# Altium schematic sheet Schematic1_1核心板.schdoc (part 3 of 3)
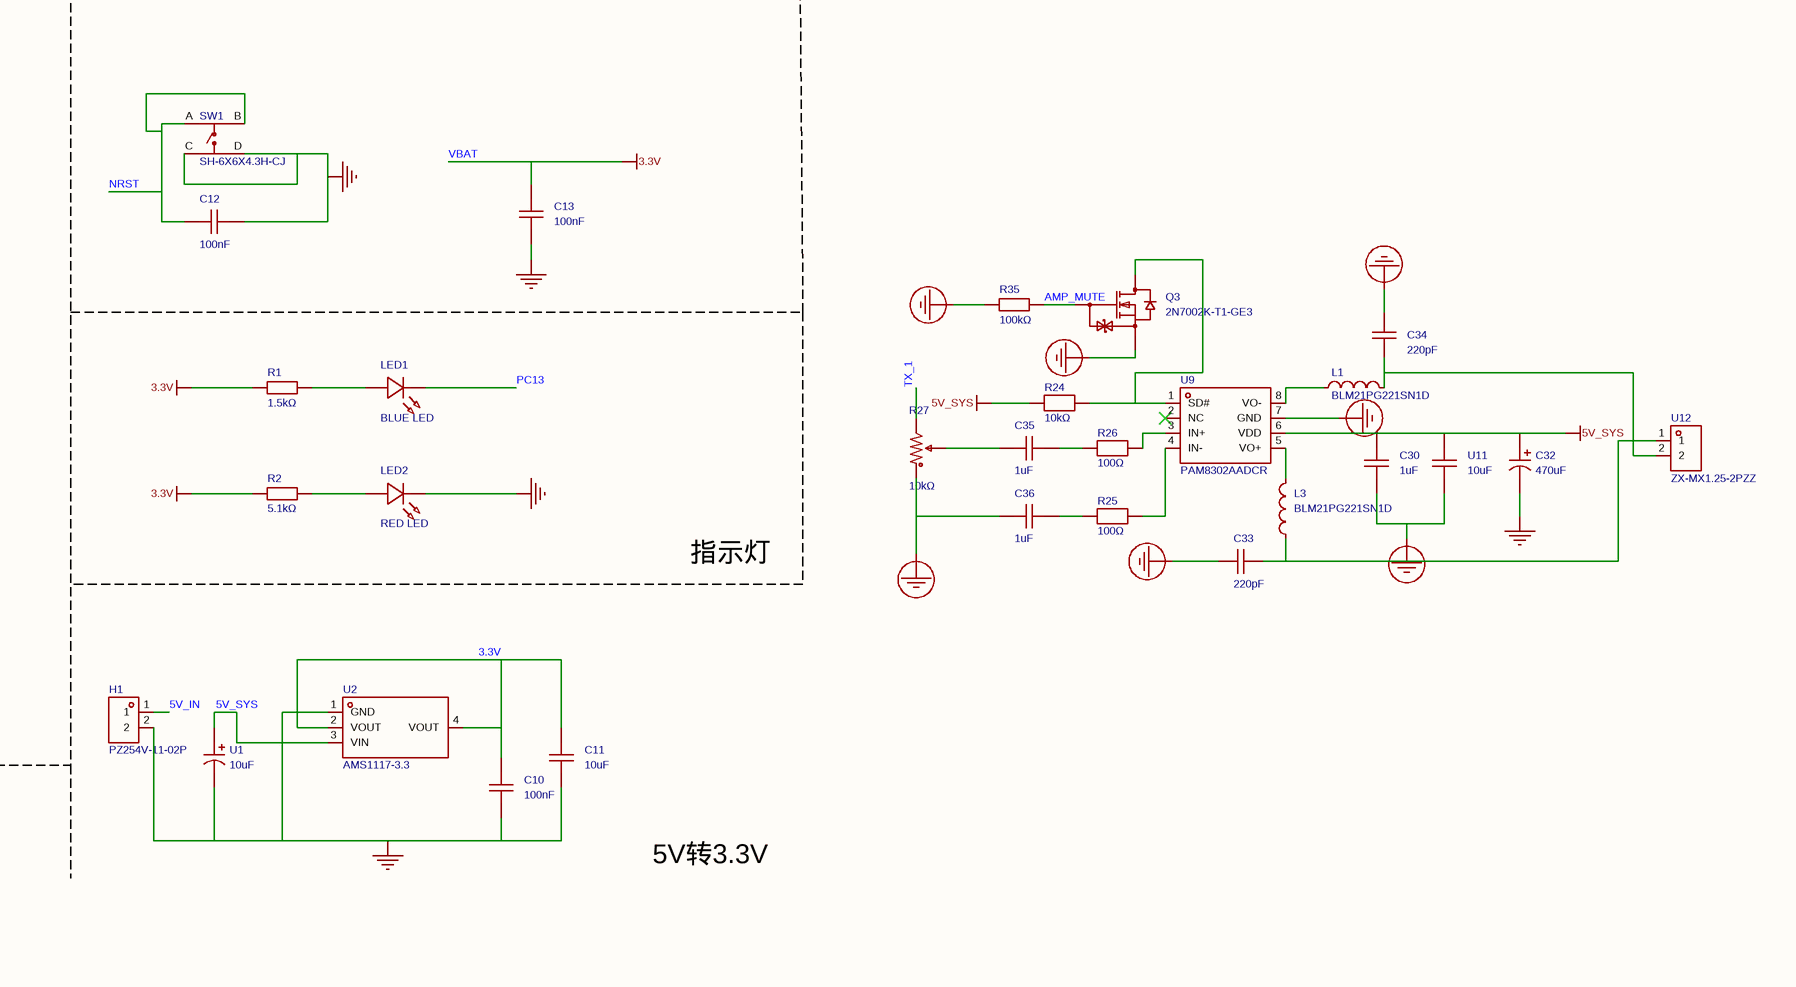
[diagram p5: Schematic1_1核心板.schdoc, bottom right]

## Library data of the parts (continued)
U8 = TPS7A2033PDBVR: 输出类型:固定;最大输入电压:6V;输出电压:3.3V;输出电流:300mA;输出极性:正极;; Manufacturer: TI(德州仪器); AddInBom: yes; ModelId: 7ba65df16e7b4570af156e925f9c37fe0819f05c4eef4c71ace90d822a990e87; ModelTransform: 114.173,114.173,0,90,0,0,0,0,0; Output Type: 固定; Maximum Input Voltage: 6V; Output Voltage: 3.3V; Output Current: 300mA; Dropout Voltage: 140mV@(300mA); standby current: 15uA; Output Polarity: 正极; Number of Outputs: 1; Symbol: TPS7A2033PDBVR; Device: TPS7A2033PDBVR; LCSC Part Name: 具有高 PSRR 的 300mA、超低噪声、低 IQ、低压降 (LDO) 线性稳压器; SupplierPart: C2862740; ManufacturerPart: TPS7A2033PDBVR; Supplier Footprint: SOT-23-5; JLCPCB Part Class: Extended Part; Datasheet: https://www.ti.com/cn/lit/gpn/tps7a20; Supplier: LCSC; ConvertToPcb: yes; FootprintName: SOT-23-5_L2.9-W1.6-P0.95-LS2.8-BR; ModelName: SOT-23-5_L2.9-W1.6-P0.95-LS2.8-BR; Feature: 防静电保护；软启动；浪涌保护；低ESR；热保护(TSD)；欠压闭锁；过流保护(OCP)；带使能；防倒灌; Operating Temperature: -40℃~+125℃@(Tj)
U9 = PAM8302AADCR: 功放类型:D类功放;扬声器通道数:单声道;输出功率:2.5Wx1@4Ω;静态电流(Iq):4mA;; Manufacturer: DIODES(美台); AddInBom: yes; ModelId: 75c24a7891ee4dd6bdac16a7163ff87e0819f05c4eef4c71ace90d822a990e87; ModelName: SOP-8_L4.9-W3.9-P1.27-LS6.0-BL-1; ModelTransform: 192.913,236.22,0,0,0,0,-0.393,2.749,0; Class: D类功放; Speaker Channels: 单声道; Total Harmonic Distortion + Noise (THD+N): 0.3%; Quiescent Current: 4mA; Signal-to-Noise Ratio: 80dB; Power Supply Rejection Ratio (PSRR): 50dB; Efficiency: 85%; Voltage - Supply: 2V~5.5V; Symbol: PAM8302AADCR; Device: PAM8302AADCR; LCSC Part Name: 2.5W单声道D类音频功率放大器; SupplierPart: C112137; ManufacturerPart: PAM8302AADCR; Supplier Footprint: SOP-8; JLCPCB Part Class: Extended Part; Datasheet: https://item.szlcsc.com/datasheet/PAM8302AADCR/113369.html; Supplier: LCSC; ConvertToPcb: yes; FootprintName: SOP-8_L4.9-W3.9-P1.27-LS6.0-BL; Output Power: 2.5Wx1@4Ω; Number of Inputs: -; Features: 无滤波器架构; Operating Temperature: -40℃~+85℃
U10 = MCP6002T-I/SN: 放大器数:2;轨到轨:轨到轨输入,轨到轨输出;增益带宽积(GBW):1MHz;输入失调电压(Vos):4.5mV;压摆率(SR):600V/ms;输入偏置电流(Ib):1pA;; Manufacturer: MICROCHIP(美国微芯); AddInBom: yes; ModelId: e81d2f7d937b4a6ab1dca543ff5d56a40819f05c4eef4c71ace90d822a990e87; ModelName: SOIC-8_L4.9-W3.9-H1.7-LS6.0-P1.27; ModelTransform: 192.913,236.22,0,0,0,0,0,0,0; Number of Channels: 2; Maximum Power Supply Range (Vdd-Vss): 7V; Gain Bandwidth Product: 1MHz; Vos - Input Offset Voltage: 4.5mV; Input Offset Voltage Drift(Vos TC): 2uV/℃; Ib - Input Bias Current: 1pA; Input Voltage Noise Density: 28nV/√Hz@1kHz; Common Mode Rejection Ratio(CMRR): 76dB; Quiescent Current: 100uA; Output Current: 23mA; Single supply: 1.8V~6V; Symbol: MCP6002T-I/SN; Device: MCP6002T-I/SN; LCSC Part Name: 1 MHz 低功耗运算放大器; SupplierPart: C7377; ManufacturerPart: MCP6002T-I/SN; Supplier Footprint: SOIC-8; JLCPCB Part Class: Extended Part; Datasheet: https://item.szlcsc.com/datasheet/MCP6002T-I%252FSN/7854.html; Supplier: LCSC; ConvertToPcb: yes; FootprintName: SOIC-8_L4.9-W3.9-P1.27-LS6.0-BL; Rail to Rail: 轨到轨输入,轨到轨输出; Slew Rate: 600V/ms; Input Offset Current(Ios): 1pA; Input offset current drift(Ios TC): -; Operating Temperature: -40℃~+125℃; Dual Supply: -; Features: -
U11 U13 = HGC0805R5106K350NSLJ: 容值:10uF;精度:±10%;额定电压:35V;温度系数:X5R;; Manufacturer: Chinocera(华瓷); 3D Model: 1ba041120af144c991958decab20d2410819f05c4eef4c71ace90d822a990e87; 3D Model Transform: 78.74,51.181,0,0,0,0,0,0.0005,0; Tolerance: ±10%; Voltage Rating: 35V; Temperature Coefficient: X5R; AddInBom: yes; ModelName: C0805_L2.0-W1.3-H1.3; Symbol: HGC0805R5106K350NSLJ; Device: HGC0805R5106K350NSLJ; LCSC Part Name: 10uF ±10% 35V; Supplier Part: C33546007; Manufacturer Part: HGC0805R5106K350NSLJ; Supplier Footprint: 0805; JLCPCB Part Class: Extended Part; Datasheet: https://item.szlcsc.com/datasheet/HGC0805R5106K350NSLJ/35278485.html; Supplier: LCSC; Value: 10uF; ConvertToPcb: yes; FootprintName: C0805
U12 = ZX-MX1.25-2PZZ: 插针结构:1x2P;间距:1.25mm;安装方式:直插;参考系列:PicoBlade(MX 1.25);总PIN数:2P;排数:1;每排PIN数:2;行距:-;额定电流:1A;触头材质:黄铜;触头镀层:锡;工作温度:-25℃~+85℃;; Manufacturer: Megastar(兆星); AddInBom: yes; ModelId: e8102c00ed5947ba8ee52e2fe36dbac20819f05c4eef4c71ace90d822a990e87; ModelTransform: 173.6217,129.921,0,0,0,0,-0.039,-15.748,-90.551; Pins Structure: 1x2P; Pitch: 1.25mm; Number of PINs Per Row: 2; Current Rating: 1A; Voltage Rating: 125V; Plastic Material: LCP; Flame Retardant Rating: UL94V-0; Z-Height of the Board: 4.6mm; X-Length of Bottom Edge on Board (Spacing Line): 4.4mm; Y-Width of Bottom Edge on Board: 3.3mm; Symbol: ZX-MX1.25-2PZZ; Device: ZX-MX1.25-2PZZ; LCSC Part Name: 1x2P 间距:1.25mm 直插 系列:PicoBlade(MX 1.25); SupplierPart: C7430458; ManufacturerPart: ZX-MX1.25-2PZZ; Supplier Footprint: 插件,P=1.25mm; JLCPCB Part Class: Extended Part; Datasheet: https://item.szlcsc.com/datasheet/ZX-MX1.25-2PZZ/8430327.html; Supplier: LCSC; ConvertToPcb: yes; FootprintName: CONN-TH_2P-P1.25_MEGASTAR_ZX-MX1.25-2PZZ; ModelName: CONN-TH_2P-P1.25_MEGASTAR_ZX-MX1.25-2PZZ; Mounting Type: 直插; Reference Series: PicoBlade(MX 1.25); Number of Pins: 2P; Number of Rows: 1; Row Spacing: -; Contact Material: 黄铜; Contact Plating: 锡; Operating Temperature: -25℃~+85℃; Supplementary Features: -; Color: 米色
U14 = FRC0805J222 TS: 电阻类型:厚膜电阻;阻值:2.2kΩ;精度:±5%;功率:125mW;工作电压:150V;温度系数:±100ppm/℃;; Manufacturer: FOJAN(富捷); AddInBom: yes; ModelId: 37a81e68749a4138bd2dfa6897b24b850819f05c4eef4c71ace90d822a990e87; ModelName: R0805_L2.0-W1.3-H0.6; ModelTransform: 78.74,51.181,0,0,0,0,0,-0.0005,0; Tolerance: ±5%; Power(Watts): 125mW; Voltage-Supply(Max): 150V; Symbol: FRC0805J222 TS; Device: FRC0805J222 TS; LCSC Part Name: 2.2kΩ ±5% 125mW 厚膜电阻; SupplierPart: C2907303; ManufacturerPart: FRC0805J222 TS; Supplier Footprint: 0805; JLCPCB Part Class: Extended Part; Supplier: LCSC; ConvertToPcb: yes; FootprintName: R0805; Type: 厚膜电阻; Value: 2.2kΩ; Temperature Coefficient: ±100ppm/℃; Operating Temperature: -55℃~+155℃
USB1 = TYPE-C 16PIN 2MD(073): 连接器类型:Type-C;协议标准:-;公母:母;安装方式:卧贴;触点数量:16P;端口数量:1;额定电流 - 电源:3A;工作温度:-25℃~+85℃;; Manufacturer: SHOU HAN(首韩); AddInBom: yes; ModelId: 3a41b9ec9b654a0fad4d118405ec62900819f05c4eef4c71ace90d822a990e87; ModelName: USB-C-SMD_TYPE-C-6PIN-2MD-073; ModelTransform: 351.9678,298.4246,0,0,0,0,0,-47.244,-35.433; Gender: 母; Number of Contacts: 16P; Number of Ports: 1; Current Rating-Power: 3A; Voltage Rating: 5V; Connect-Disconnect Life: 1万次; Detection color: 黑色; Symbol: TYPE-C 16PIN 2MD(073); Device: TYPE-C 16PIN 2MD(073); LCSC Part Name: Type-C 母 卧贴; SupplierPart: C2765186; ManufacturerPart: TYPE-C 16PIN 2MD(073); Supplier Footprint: SMD; JLCPCB Part Class: Extended Part; Datasheet: https://item.szlcsc.com/datasheet/TYPE-C%252016PIN%25202MD(073)/2901843.html; Supplier: LCSC; ConvertToPcb: yes; FootprintName: USB-C-SMD_TYPE-C-16PIN-2MD-073; Connector Type: Type-C; Protocol Standard: -; Mounting Type: 卧贴; Supplementary Features: -; Center Height: -; Length: -; Operating Temperature: -25℃~+85℃
X5 = X1E0000210621: 晶振类型:贴片晶振;频率:25MHz;常温频差:±10ppm;负载电容:9pF;; Manufacturer: EPSON(爱普生); AddInBom: yes; ModelId: ff2dfd5650294453a14147960efe18380819f05c4eef4c71ace90d822a990e87; ModelTransform: 125.984,98.425,0,0,0,0,0,0,0; Normal temperature Frequency Tolerance: ±10ppm; Load Capacitance: 9pF; Equivalent Series Resistance(ESR): 40Ω; Symbol: X1E0000210621; Device: X1E0000210621; LCSC Part Name: 25MHz ±10ppm 9pF; SupplierPart: C255920; ManufacturerPart: X1E0000210621; Supplier Footprint: SMD3225-4P; JLCPCB Part Class: Extended Part; Datasheet: https://item.szlcsc.com/datasheet/X1E0000210621/249685.html; Supplier: LCSC; ConvertToPcb: yes; FootprintName: CRYSTAL-SMD_4P-L3.2-W2.5-BL; ModelName: CRYSTAL-SMD_4P-L3.2-W2.5-BL; Type: 贴片晶振; Value: 25MHz; Operating Temperature: -40℃~+85℃